# EAGLE design schematics (EAGLE 7.5.0)
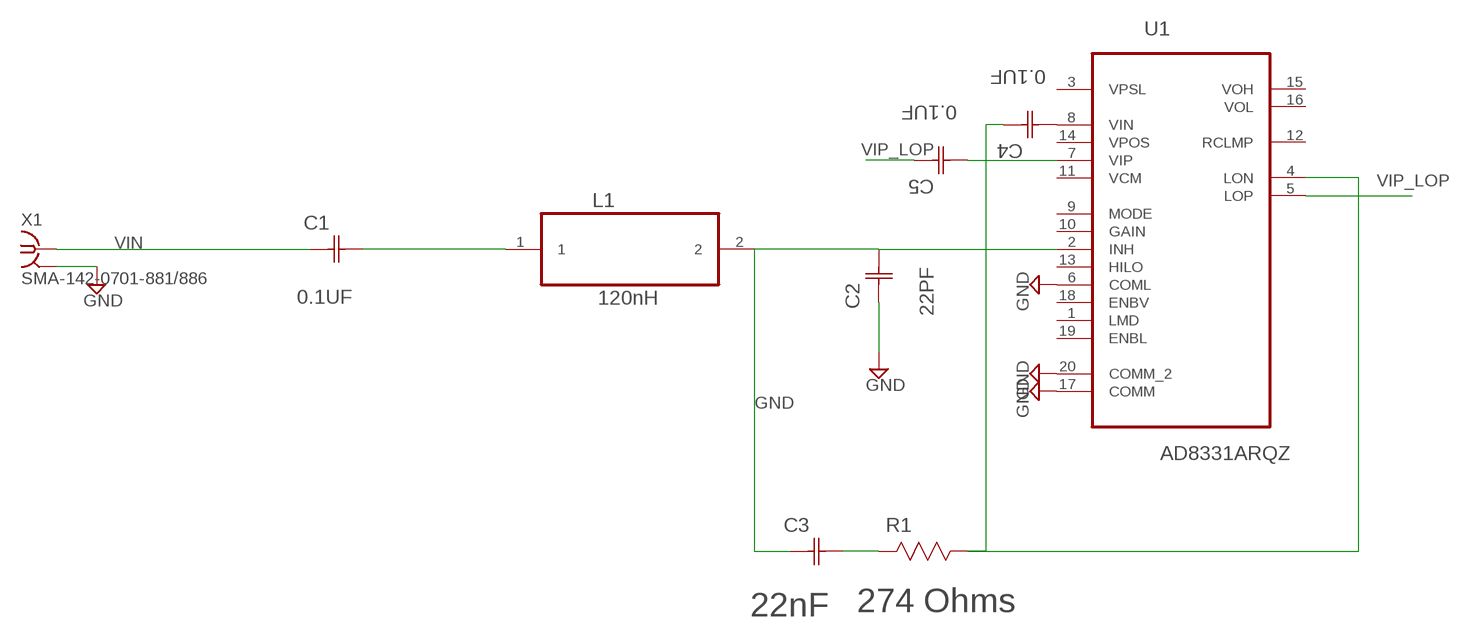
[diagram p0: schematic, sheet 1]

## Parts
C1  0.1UF  12065C104JAT2A  [CAPC3216X94N]
C2  22PF  12063A220JAT2A  [CAPC3216X94N]
C3  22nF  C0805F223K5RACAUTO  [CAPC2013X88N]
C4  0.1UF  12065C104JAT2A  [CAPC3216X94N]
C5  0.1UF  12065C104JAT2A  [CAPC3216X94N]
L1  120nH  B82498F3121J  [INDC2317X140N]
R1  274 Ohms  CRCW1206274RFKEA  [RESC3216X71N]
U1  AD8331ARQZ  [SOP64P600X165-20N]
X1  SMA-142-0701-881/886  [J502-ND-142-0701-881/886]

## Nets
GND: C2.1(C1) U1.6(COML) U1.17(COMM) U1.20(COMM_2) X1.G@1 X1.G@2 X1.G@3 X1.G@4
N$1: C1.2(C2) L1.1
N$2: C2.2(C2) C3.1(C1) L1.2 U1.2(INH)
N$3: C3.2(C2) R1.2
N$4: C4.1(C1) R1.1 U1.4(LON)
N$5: C4.2(C2) U1.8(VIN)
N$6: C5.2(C2) U1.7(VIP)
VIN: C1.1(C1) X1.1
VIP_LOP: C5.1(C1) U1.5(LOP)
Unconnected: U1.1(LMD) U1.9(MODE) U1.10(GAIN) U1.11(VCM) U1.12(RCLMP) U1.13(HILO) U1.15(VOH) U1.16(VOL) U1.18(ENBV) U1.19(ENBL)

## Power pins joined to a net without a drawn wire
VPOS: U1.14(VPOS)
VPSL: U1.3(VPSL)

## Library data of the parts
C1 C4 C5 = AVX_By_element14_Batch_1:12065C104JAT2A: Capacitor, 1206; MPN: 12065C104JAT2A; OC_FARNELL: 1582772; OC_NEWARK: 96M1508; SUPPLIER: AVX; TOLERANCE: ± 5%; VOLTAGERATING: 50V
C2 = AVX_By_element14_Batch_1:12063A220JAT2A: Capacitor, 1206; MPN: 12063A220JAT2A; OC_FARNELL: -; OC_NEWARK: 55J9107; SUPPLIER: AVX; TOLERANCE: ±5%; VOLTAGERATING: 25V
C3 = Kemet_By_element14_Batch_1:C0805F223K5RACAUTO: CAPACITOR, 0805; MPN: C0805F223K5RACAUTO; OC_FARNELL: 1869052; OC_NEWARK: 32T6749; SUPPLIER: KEMET; TOLERANCE: ±10%; VOLTAGERATING: 50V
L1 = Epcos_By_element14_Batch_1:B82498F3121J: SMT inductors; MPN: B82498F3121J; OC_FARNELL: 1825882; OC_NEWARK: 06J1037; SUPPLIER: EPCOS; TOLERANCE: ±5%
R1 = Vishay_By_element14_Batch_1:CRCW1206274RFKEA: RESISTOR, 1206; MPN: CRCW1206274RFKEA; OC_FARNELL: 1180266; OC_NEWARK: 53K2204; SUPPLIER: Vishay; TOLERANCE: ±1%; WATTAGE: 0.25W
U1 = Analog Devices_By_element14_Batch_1:AD8331ARQZ: Preamplifier and Programmable RIN; MPN: AD8331ARQZ; OC_FARNELL: 1581949; OC_NEWARK: 59K6617; PACKAGE: TSSOP-20; SUPPLIER: ANALOG DEVICES
X1 = con-coax:SMA-: SMA 50 Ohm End Launch Jack Receptacle - Round Contact Johnson Components Source: www.johnsoncomponents.com .. J502-ND.pdf; MF: JOHNSON COMPONENTS; MPN: 142-0701-881; OC_FARNELL: 1608603; OC_NEWARK: 08B906

## Board
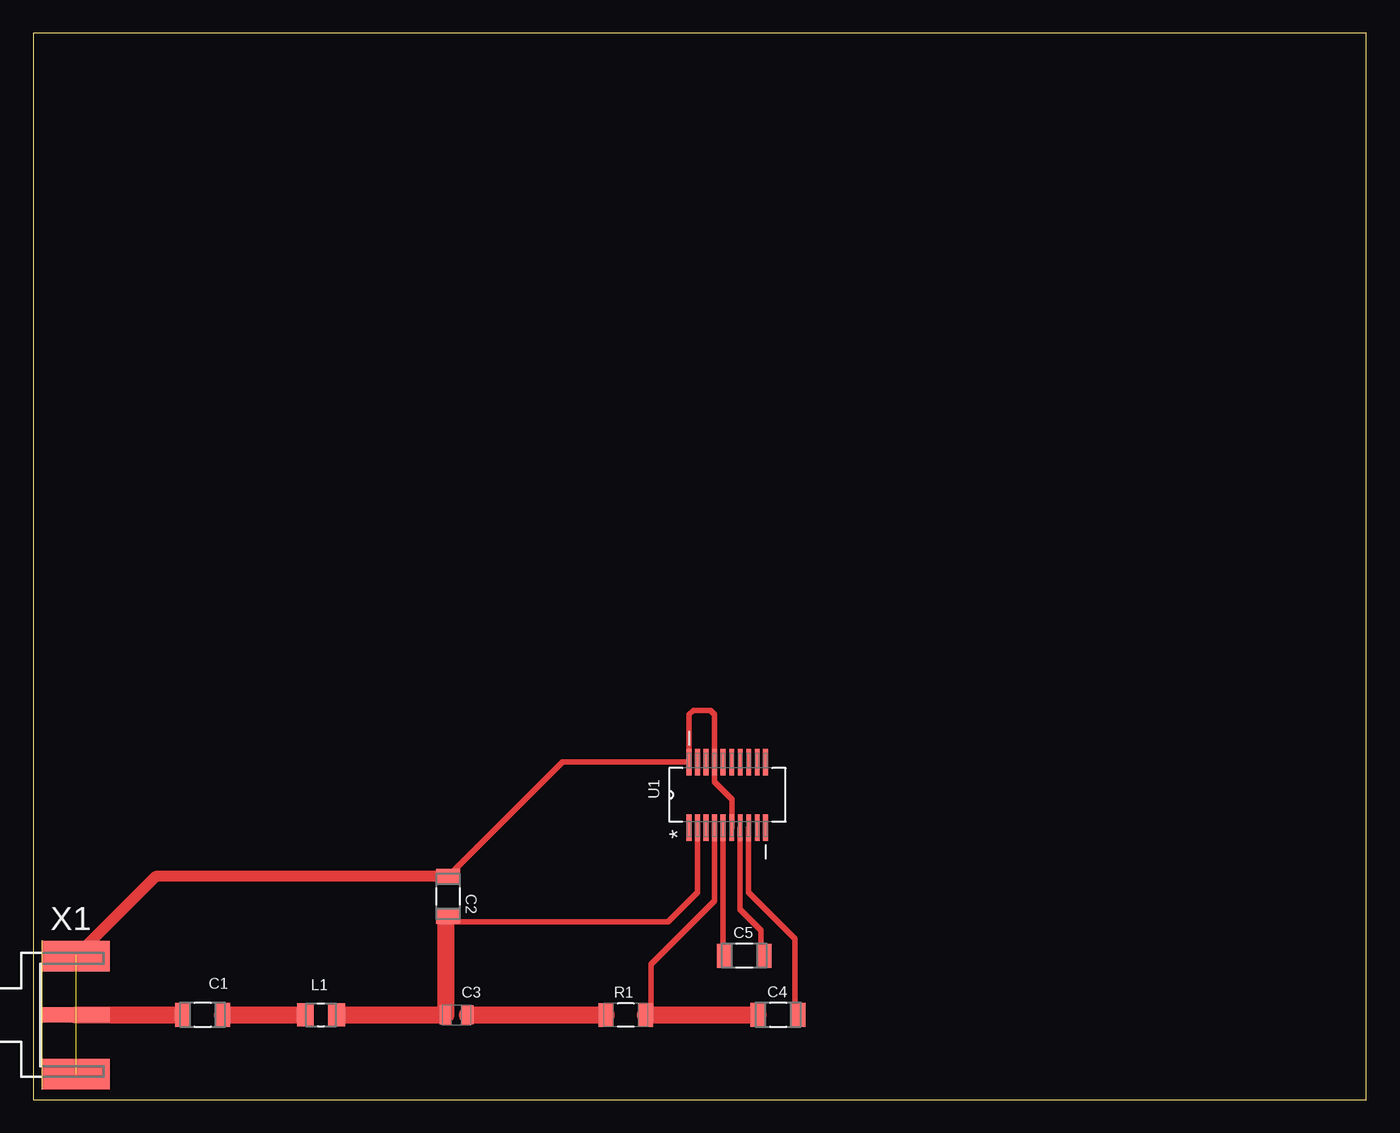
[diagram p1: board, top side]
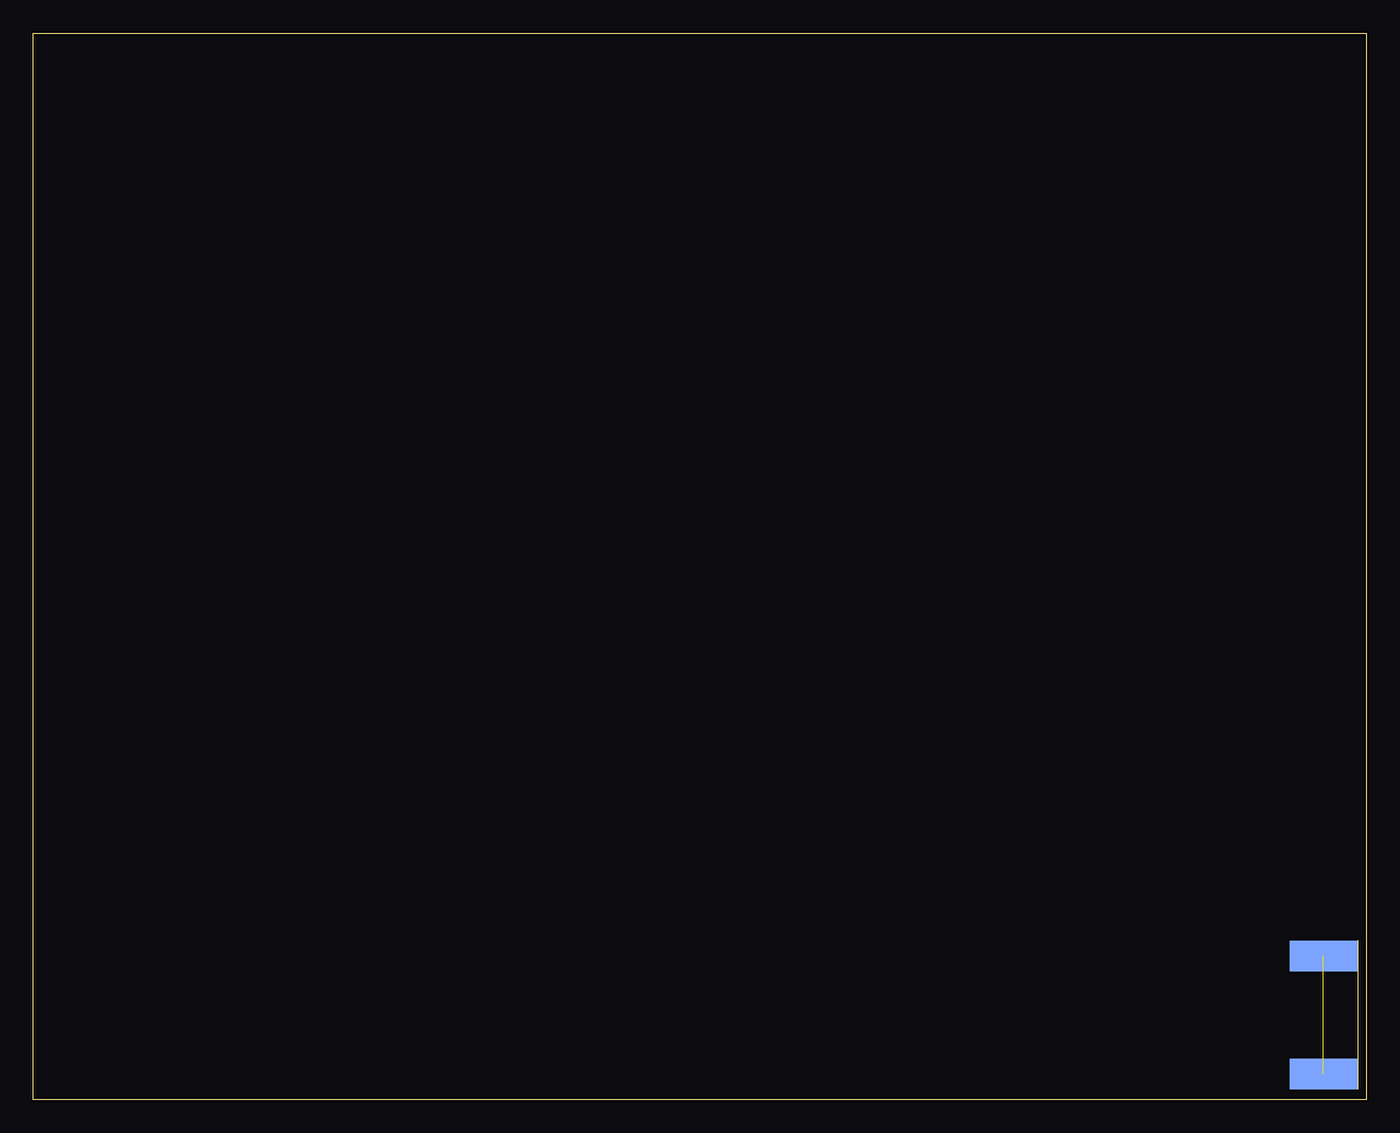
[diagram p2: board, bottom side, seen from below]

Size 100 x 80 mm. Coordinates in mm from the lower left corner, seen from the top.
Outline: 0,0 100,0 100,80 0,80 0,0
Copper layers (1*16): Top 0.035mm / dielectric 1.5mm / Bottom 0.035mm
Design rules "default": minimum track width 10mil, minimum drill 24mil, track to track 8mil, track to pad 8mil, pad to pad 8mil, via to via 8mil, smd to smd 8mil, copper to edge 40mil, drill to drill 8mil, minimum pad ring 10mil, minimum via ring 8mil, stop-mask expansion 4mil, vias tented up to drill 0mil, thermal gap 10mil

### Footprints (pad centres in the part's own frame; a part is rotated, then mirrored left to right if it is on the bottom)
CAPC3216X94N = smd 1.118 x 1.803: 1 -1.499,0; 2 1.499,0
CAPC2013X88N = smd 0.914 x 1.448: 1 -0.813,0; 2 0.813,0
INDC2317X140N = smd 1.245 x 1.702: 1 -1.168,0; 2 1.168,0
RESC3216X71N = smd 1.118 x 1.753: 1 -1.473,0; 2 1.473,0
SOP64P600X165-20N = smd 1.981 x 0.356: 1 -2.464,2.87; 2 -2.464,2.235; 3 -2.464,1.6; 4 -2.464,0.965; 5 -2.464,0.33; 6 -2.464,-0.33; 7 -2.464,-0.965; 8 -2.464,-1.6; 9 -2.464,-2.235; 10 -2.464,-2.87; 11 2.464,-2.87; 12 2.464,-2.235; 13 2.464,-1.6; 14 2.464,-0.965; 15 2.464,-0.33; 16 2.464,0.33; 17 2.464,0.965; 18 2.464,1.6; 19 2.464,2.235; 20 2.464,2.87
J502-ND-142-0701-881/886 = smd 5.08 x 1.143: 1 2.565,0 | smd 5.08 x 2.286: G@1 2.565,4.42; G@2 2.565,-4.42 | smd 5.08 x 2.286 bottom: G@3 2.565,4.42; G@4 2.565,-4.42

### Placement (x,y rotation side)
C1  12.7,6.35 0 top
C2  31.11,15.24 270 top
C3  31.75,6.35 0 top
C4  55.88,6.35 0 top
C5  53.34,10.79 0 top
L1  21.59,6.35 0 top
R1  44.45,6.35 180 top
U1  52.07,22.86 90 top
X1  0.64,6.35 0 top

### Tracks (layer width: path | path; a pad name or v marks a point on that pad's centre or on a via)
GND  (3 unrouted)
  Top 0.406: C2.1 39.7,25.32 U1.20 49.2,28.88 49.53,29.21 50.8,29.21 51.1,28.91 U1.17 51.1,23.82 52.4,22.53 U1.6
  Top 0.813: C2.1 9.17,16.74 X1.G@3
N$1
  Top 1.27: C1.2 L1.1
N$2
  Top 0.406: U1.2 49.84,15.54 47.62,13.34 31.52,13.34 C2.2
  Top 1.27: L1.2 C3.1 30.94,13.74 C2.2
N$3
  Top 1.27: C3.2 R1.2
N$4
  Top 0.406: U1.4 51.1,14.91 46.35,10.16 46.35,6.78 R1.1
  Top 1.27: R1.1 C4.1
N$5
  Top 0.406: U1.8 53.67,15.54 57.15,12.06 57.15,6.58 C4.2
N$6
  Top 0.406: U1.7 53.03,14.28 54.61,12.7 54.61,11.02 C5.2
VIN
  Top 1.27: X1.1 C1.1
VIP_LOP
  Top 0.406: U1.5 51.74,10.9 C5.1